# EAGLE schematic DisplayBoardMk1 (EAGLE 9.2.0)
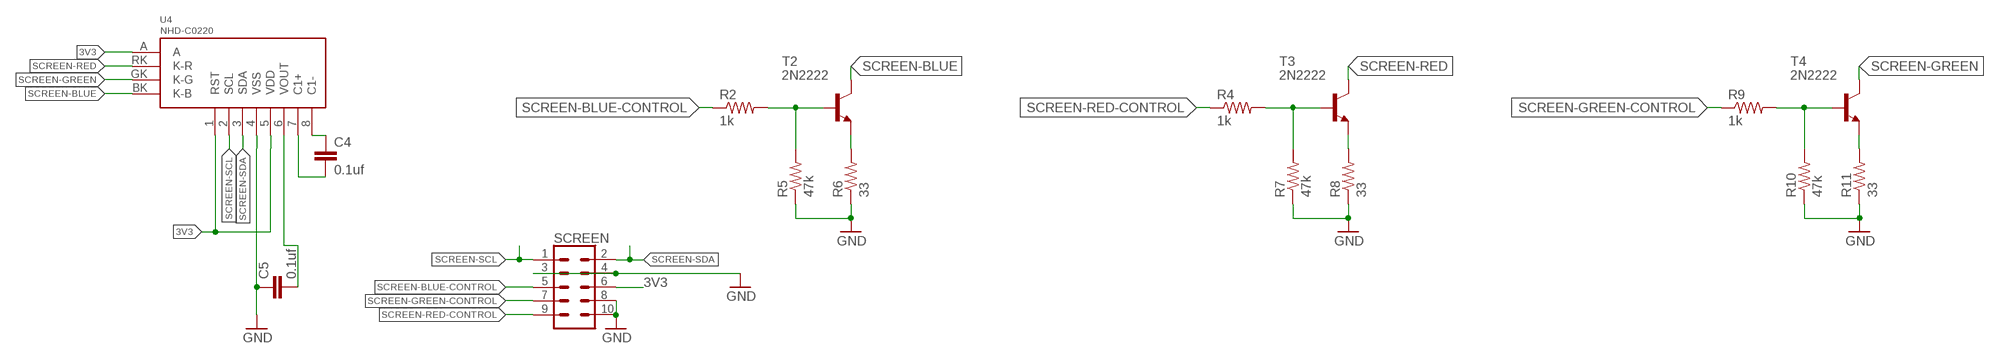
[diagram p0: schematic, sheet 1]

## Parts
C4  0.1uf  C2.5/4  [C2.5-4]
C5  0.1uf  C2.5/4  [C2.5-4]
R2  1k  R-US_0207/12  [0207/12]
R4  1k  R-US_0207/12  [0207/12]
R5  47k  R-US_0207/12  [0207/12]
R6  33  R-US_0207/12  [0207/12]
R7  47k  R-US_0207/12  [0207/12]
R8  33  R-US_0207/12  [0207/12]
R9  1k  R-US_0207/12  [0207/12]
R10  47k  R-US_0207/12  [0207/12]
R11  33  R-US_0207/12  [0207/12]
SCREEN  CONN_05X2SHD  [2X5-SHROUDED]
T2  2N2222  [TO18]
T3  2N2222  [TO18]
T4  2N2222  [TO18]
U4  NHD‐C0220  [NHD-C0220]

## Nets
3V3: SCREEN.6 U4.1(RST) U4.5(VDD) U4.A
BLUE-NPN-BASE: R2.2 R5.2 T2.2(B)
BLUE-NPN-EMITTER: R6.2 T2.1(E)
GND: C5.1 R5.1 R6.1 R7.1 R8.1 R10.1 R11.1 SCREEN.3 SCREEN.4 SCREEN.8 SCREEN.10 U4.4(VSS)
GREEN-NPN-BASE: R9.2 R10.2 T4.2(B)
GREEN-NPN-EMITTER: R11.2 T4.1(E)
N$3: C5.2 U4.6(VOUT)
N$21: C4.2 U4.7(C1+)
N$22: C4.1 U4.8(C1-)
RED-NPN-BASE: R4.2 R7.2 T3.2(B)
RED-NPN-EMITTER: R8.2 T3.1(E)
SCREEN-BLUE: T2.3(C) U4.BK(K-B)
SCREEN-BLUE-CONTROL: R2.1 SCREEN.5
SCREEN-GREEN: T4.3(C) U4.GK(K-G)
SCREEN-GREEN-CONTROL: R9.1 SCREEN.7
SCREEN-RED: T3.3(C) U4.RK(K-R)
SCREEN-RED-CONTROL: R4.1 SCREEN.9
SCREEN-SCL: SCREEN.1 U4.2(SCL)
SCREEN-SDA: SCREEN.2 U4.3(SDA)

## Library data of the parts
C4 C5 = capacitor-wima:C: CAPACITOR naming: grid - package width
R2 R4-R11 = resistor:R-US_: RESISTOR, American symbol
SCREEN = SparkFun-Connectors:CONN_05X2: Multi connection point. Often used as Generic Header-pin footprint for 0.1 inch spaced/style header connections For AVR SPI programming port, see special device with nice symbol: "AVR_SPI_PROG_5x2.dev" You can populate with any combo of single row headers, but if you'd like an exact match, check these: 2x5 AVR ICSP Male Header <https://www.sparkfun.com/products/778> (PRT-00778) 2x5 Pin Shrouded Header <https://www.sparkfun.com/products/8506> (PRT-08506) On any of the 0.1 inch spaced packages, you can populate with these: Break Away Headers - Straight <https://www.sparkfun.com/products/116> (PRT-00116) Break Away Male Headers - Right Angle <https://www.sparkfun.com/products/553> (PRT-00553) Female Headers <https://www.sparkfun.com/products/115> (PRT-00115) Break Away Headers - Machine Pin <https://www.sparkfun.com/products/117> (PRT-00117) Break Away Female Headers - Swiss Machine Pin <https://www.sparkfun.com/products/743> (PRT-00743) Special note: the shrouded connector mates well with our 5x2 ribbon cables: 2x5 Pin IDC Ribbon Cable <https://www.sparkfun.com/products/8535> (PRT-08535); PROD_ID: CONN-08671; SF_ID: PRT-08506
T2-T4 = transistor:2N2222: NPN TRANSISTOR
U4 = GEMS:NHD‐C0220